# Altium schematic sheet 7_5G模块电源.SchDoc
size A4
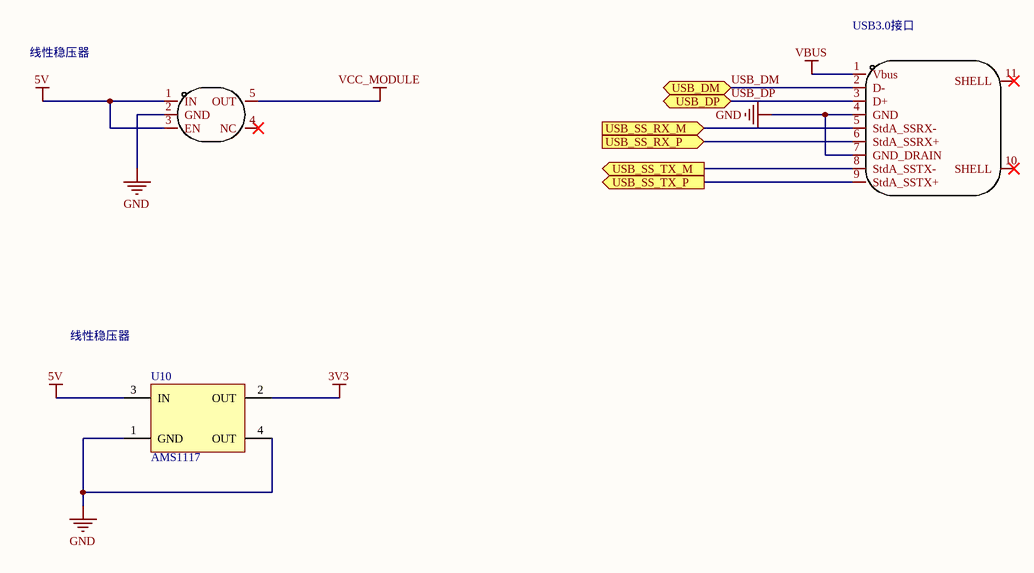
[diagram p0: 7_5G模块电源.SchDoc]

## Parts
U9  TLV70237DBVR  [SOT-23-5_L2.9-W1.6-P0.95-LS2.8-BR]  (value not drawn)
U10  AMS1117  [SOT223_4]
USB3  HC-ST-003-01-J  [USB-3.0-A-TH_HC-ST-003-01-Z]  (value not drawn)

## Ports
USB_DM (bidir), USB_DP (bidir), USB_SS_RX_M (in), USB_SS_RX_P (in), USB_SS_TX_M (out), USB_SS_TX_P (out)

## Nets
3V3: U10.2(OUT)
5V: U9.1(IN) U9.3(EN) U10.3(IN)
GND: U9.2(GND) U10.1(GND) U10.4(OUT) USB3.4(GND) USB3.7(GND_DRAIN)
VBUS: USB3.1(Vbus)
VCC_MODULE: U9.5(OUT)
USB_DM: USB3.2(D-) ; port USB_DM
USB_DP: USB3.3(D+) ; port USB_DP
USB_SS_RX_M: USB3.5(StdA_SSRX-) ; port USB_SS_RX_M
USB_SS_RX_P: USB3.6(StdA_SSRX+) ; port USB_SS_RX_P
USB_SS_TX_M: USB3.8(StdA_SSTX-) ; port USB_SS_TX_M
USB_SS_TX_P: USB3.9(StdA_SSTX+) ; port USB_SS_TX_P

Not connected (* = marked no-connect by the designer): U9 4(NC)*; USB3 10(SHELL)* 11(SHELL)*

## Notes on the sheet
- (near USB3) USB3.0接口
- 线性稳压器

## Library data of the parts
U9 = TLV70237DBVR: Add into BOM: yes; Symbol: TLV70237DBVR; Device: TLV70237DBVR; LCSC Part Name: TLV70237DBVR; Supplier Part: C2877850; Manufacturer Part: TLV70237DBVR; Supplier Footprint: SOT-23-5; JLCPCB Part Class: Extended Part; Supplier: LCSC; Convert to PCB: yes
USB3 = HC-ST-003-01-J: Add into BOM: yes; Connector Type: Type-A; Number of Ports: 1; Number of Contacts: 9P; Current Rating - Power (Max): 1.5A; Symbol: HC-ST-003-01-J; Device: HC-ST-003-01-J; Supplier: LCSC; Supplier Part: C2845330; Manufacturer Part: HC-ST-003-01-J; JLCPCB Part Class: Extended Part; Datasheet: https://atta.szlcsc.com/upload/public/pdf/source/20221116/DADAB294700AAF55209BD8638F95257E.pdf; Convert to PCB: yes; Standard: USB 3.0